# EAGLE design Grove expansion v4 for box (EAGLE 9.4.2)

## Sheet 1 of 2
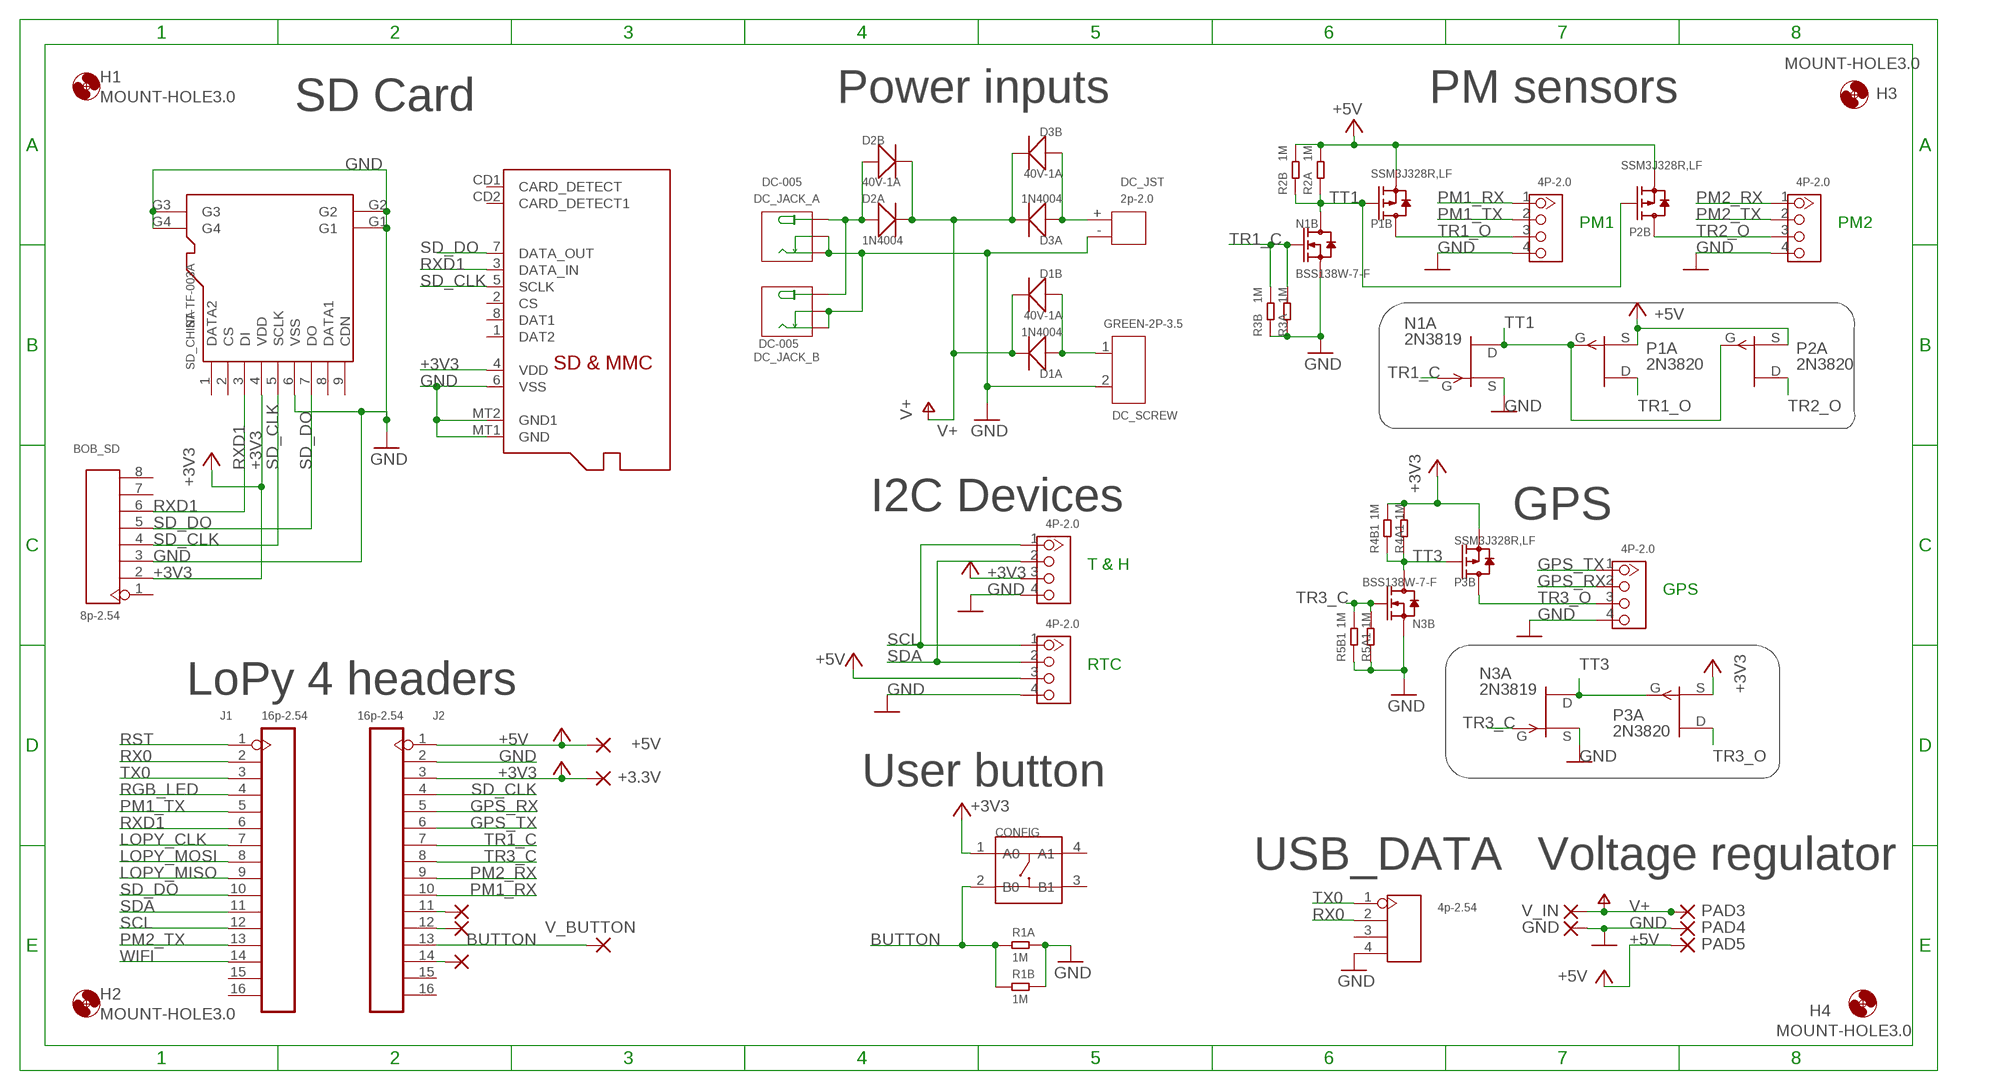
[diagram p0: schematic, sheet 1]

### Parts
+3.3V  2,15/1,0  [2,15/1,0]
+5V  2,15/1,0  [2,15/1,0]
BOB_SD  8p-2.54  DIP-BLACK-FEMALE-HEADER-VERT(8P-2.54)  [H8-2.54]
CONFIG  DIP-SWITCH-TACTILE-SPST-NO/TS-1109(4P-D6.0MM)'TS-1109'  [SW4-6.0X6.0X5.0MM]
D1A  1N4004  DIP-DIODE-400V-1A(DO-41)  [DO-41]
D1B  40V-1A  SMD-DIODE-SCHOTTKY-40V-1A(DO-214AC)  [DO-214AC]
D2A  1N4004  DIP-DIODE-400V-1A(DO-41)  [DO-41]
D2B  40V-1A  SMD-DIODE-SCHOTTKY-40V-1A(DO-214AC)  [DO-214AC]
D3A  1N4004  DIP-DIODE-400V-1A(DO-41)  [DO-41]
D3B  40V-1A  SMD-DIODE-SCHOTTKY-40V-1A(DO-214AC)  [DO-214AC]
DC_JACK_A  DC-005  CONN-POWER-JACK-2.1MM(DC-005)  [DCJ3P-14.2X11.0X9.0MM]
DC_JACK_B  DC-005  CONN-POWER-JACK-2.1MM(DC-005)  [DCJ3P-14.2X11.0X9.0MM]
DC_JST  2p-2.0  DIP-JST-2P-2.0  [H2-2.0-6X4.5MM]
DC_SCREW  GREEN-2P-3.5  SCREW-TERMINAL-GREEN(2P-3.5)  [H2-3.5-7.0X7.0MM]
GND  2,15/1,0  [2,15/1,0]
GPS-(DIG)  4P-2.0  GROVE-CONNECTOR-DIP(4P-2.0)  [HW4-2.0]
H1  MOUNT-HOLE3.0  [3,0]
H2  MOUNT-HOLE3.0  [3,0]
H3  MOUNT-HOLE3.0  [3,0]
H4  MOUNT-HOLE3.0  [3,0]
J1  16p-2.54  DIP-BLACK-MALE-HEADER-VERT(16P-2.54)  [H16-2.54]
J2  16p-2.54  DIP-BLACK-MALE-HEADER-VERT(16P-2.54)  [H16-2.54]
N1A  2N3819  [TO92]
N1B  BSS138W-7-F  SMD-MOSFET-N-CH-50V-200MA-BSS138W-7-F(SOT-23)  [SOT-23]
N3A  2N3819  [TO92]
N3B  BSS138W-7-F  SMD-MOSFET-N-CH-50V-200MA-BSS138W-7-F(SOT-23)  [SOT-23]
P1A  2N3820  [TO92]
P1B  SSM3J328R,LF  SMD-MOSFET-P-CH-20V-6A-SSM3J328R(SOT-23)  [SOT-23]
P2A  2N3820  [TO92]
P2B  SSM3J328R,LF  SMD-MOSFET-P-CH-20V-6A-SSM3J328R(SOT-23)  [SOT-23]
P3A  2N3820  [TO92]
P3B  SSM3J328R,LF  SMD-MOSFET-P-CH-20V-6A-SSM3J328R(SOT-23)  [SOT-23]
P13  2,15/1,0  [2,15/1,0]
P15  2,15/1,0  [2,15/1,0]
P16  2,15/1,0  [2,15/1,0]
PAD3  1,6/0,8  [1,6/0,8]
PAD4  1,6/0,8  [1,6/0,8]
PAD5  1,6/0,8  [1,6/0,8]
PM1-(UART)  4P-2.0  GROVE-CONNECTOR-DIP(4P-2.0)  [HW4-2.0]
PM2-(UART)  4P-2.0  GROVE-CONNECTOR-DIP(4P-2.0)  [HW4-2.0]
R1A  1M  DIP-RES-1M-5%-1/4W(PR-D2.3XL6.5MM)  [PR-D2.3XL6.5MM]
R1B  1M  SMD-RES-1M-1%-1/10W(0603)  [R0603]
R2A  1M  DIP-RES-1M-5%-1/4W(PR-D2.3XL6.5MM)  [PR-D2.3XL6.5MM]
R2B  1M  SMD-RES-1M-1%-1/10W(0603)  [R0603]
R3A  1M  DIP-RES-1M-5%-1/4W(PR-D2.3XL6.5MM)  [PR-D2.3XL6.5MM]
R3B  1M  SMD-RES-1M-1%-1/10W(0603)  [R0603]
R4A1  1M  DIP-RES-1M-5%-1/4W(PR-D2.3XL6.5MM)  [PR-D2.3XL6.5MM]
R4B1  1M  SMD-RES-1M-1%-1/10W(0603)  [R0603]
R5A1  1M  DIP-RES-1M-5%-1/4W(PR-D2.3XL6.5MM)  [PR-D2.3XL6.5MM]
R5B1  1M  SMD-RES-1M-1%-1/10W(0603)  [R0603]
RTC-(I2C)  4P-2.0  GROVE-CONNECTOR-DIP(4P-2.0)  [HW4-2.0]
SD_CHINA  ST-TF-003A  MICRO-SD-CARD-SOCKET-9P(ST-TF-003A)  [MICRO-SD9+4P-SMD-16.1X14.5X1.85MM]
SD_UK  MICROSD  [MICROSD]
TH-(I2C)  4P-2.0  GROVE-CONNECTOR-DIP(4P-2.0)  [HW4-2.0]
USB_DATA  4p-2.54  DIP-BLACK-FEMALE-HEADER-VERT(4P-2.54)  [H4-2.54]
V_BUTTON  2,15/1,0  [2,15/1,0]
V_IN  2,15/1,0  [2,15/1,0]

### Nets
+3V3: +3.3V.1(P) BOB_SD.2 CONFIG.1(A0) J2.3 P3A.1(S) P3B.2(S) R4A1.2 R4B1.2 SD_CHINA.4(VDD) SD_UK.4(VDD) TH-(I2C).3
+5V: +5V.1(P) J2.1 P1A.1(S) P1B.2(S) P2A.1(S) P2B.2(S) PAD5.1(P) R2A.2 R2B.2 RTC-(I2C).3
BUTTON: CONFIG.2(B0) J2.13 R1A.1 R1B.1 V_BUTTON.1(P)
GND: BOB_SD.3 DC_JACK_A.-1(-) DC_JACK_A.-2(CDN) DC_JACK_B.-1(-) DC_JACK_B.-2(CDN) DC_JST.- DC_SCREW.2 GND.1(P) GPS-(DIG).4 J2.2 N1A.3(S) N1B.2(S) N3A.3(S) N3B.2(S) PAD4.1(P) PM1-(UART).4 PM2-(UART).4 R1A.2 R1B.2 R3A.1 R3B.1 R5A1.1 R5B1.1 RTC-(I2C).4 SD_CHINA.6(VSS) SD_CHINA.G1 SD_CHINA.G2 SD_CHINA.G3 SD_CHINA.G4 SD_UK.6(VSS) SD_UK.MT1(GND) SD_UK.MT2(GND1) TH-(I2C).4 USB_DATA.4
GPS_RX: GPS-(DIG).2 J2.5
GPS_TX: GPS-(DIG).1 J2.6
JACK_V+: D2A.1(+) D2B.1(+) DC_JACK_A.+ DC_JACK_B.+
JST_V+: D3A.1(+) D3B.1(+) DC_JST.+
LOPY_CLK: J1.7
LOPY_MISO: J1.9
LOPY_MOSI: J1.8
N$1: J2.11 P16.1(P)
N$2: J2.12 P15.1(P)
N$3: J2.14 P13.1(P)
PM1_RX: J2.10 PM1-(UART).1
PM1_TX: J1.5 PM1-(UART).2
PM2_RX: J2.9 PM2-(UART).1
PM2_TX: J1.13 PM2-(UART).2
RGB_LED: J1.4
RST: J1.1
RX0: J1.2 USB_DATA.2
RXD1: BOB_SD.6 J1.6 SD_CHINA.3(DI) SD_UK.3(DATA_IN)
SCL: J1.12 RTC-(I2C).1 TH-(I2C).1
SCREW_V+: D1A.1(+) D1B.1(+) DC_SCREW.1
SD_CLK: BOB_SD.4 J2.4 SD_CHINA.5(SCLK) SD_UK.5(SCLK)
SD_DO: BOB_SD.5 J1.10 SD_CHINA.7(DO) SD_UK.7(DATA_OUT)
SDA: J1.11 RTC-(I2C).2 TH-(I2C).2
TR1_C: J2.7 N1A.2(G) N1B.1(G) R3A.2 R3B.2
TR1_O: P1A.3(D) P1B.3(D) PM1-(UART).3
TR2_O: P2A.3(D) P2B.3(D) PM2-(UART).3
TR3_C: J2.8 N3A.2(G) N3B.1(G) R5A1.2 R5B1.2
TR3_O: GPS-(DIG).3 P3A.3(D) P3B.3(D)
TT1: N1A.1(D) N1B.3(D) P1A.2(G) P1B.1(G) P2A.2(G) P2B.1(G) R2A.1 R2B.1
TT3: N3A.1(D) N3B.3(D) P3A.2(G) P3B.1(G) R4A1.1 R4B1.1
TX0: J1.3 USB_DATA.1
V+: D1A.2(-) D1B.2(-) D2A.2(-) D2B.2(-) D3A.2(-) D3B.2(-) PAD3.1(P) V_IN.1(P)
WIFI: J1.14
Unconnected: BOB_SD.1 BOB_SD.7 BOB_SD.8 CONFIG.3(B1) CONFIG.4(A1) J1.15 J1.16 J2.15 J2.16 SD_CHINA.1(DATA2) SD_CHINA.2(CS) SD_CHINA.8(DATA1) SD_CHINA.9(CDN) SD_UK.1(DAT2) SD_UK.2(CS) SD_UK.8(DAT1) SD_UK.CD1(CARD_DETECT) SD_UK.CD2(CARD_DETECT1) USB_DATA.3

### Notes on the sheet
- SD Card | Power inputs | PM sensors
- PM1 | PM2
- I2C Devices | GPS
- T & H
- GPS
- RTC
- LoPy 4 headers
- User button
- Voltage regulator

## Sheet 2 of 2

## Library data of the parts
+3.3V +5V GND P13 P15 P16 V_BUTTON V_IN = wirepad:2,15/1,0: THROUGH-HOLE PAD
BOB_SD = OPL_Connector:DIP-BLACK-FEMALE-HEADER-VERT(8P-2.54): 320030061; MPN: F185-1108A1BSYC1
CONFIG = OPL_Switch:DIP-SWITCH-TACTILE-SPST-NO/TS-1109(4P-D6.0MM): 311020024
D1A D2A D3A = OPL_Discrete_Semiconductor:DIP-DIODE-400V-1A(DO-41): 304010008; MPN: 1N4004
D1B D2B D3B = OPL_Discrete_Semiconductor:SMD-DIODE-SCHOTTKY-40V-1A(DO-214AC): 304020027; MPN: 1N5819
DC_JACK_A DC_JACK_B = OPL_Connector:CONN-POWER-JACK-2.1MM(DC-005): 320120003; MPN: DC-005
DC_JST = OPL_Connector:DIP-JST-2P-2.0: 320110049
DC_SCREW = OPL_Connector:SCREW-TERMINAL-GREEN(2P-3.5): 320110028
GPS-(DIG) PM1-(UART) PM2-(UART) RTC-(I2C) TH-(I2C) = OPL_Connector:GROVE-CONNECTOR-DIP(4P-2.0): 320110033
H1-H4 = holes:MOUNT-HOLE: MOUNTING HOLE with drill center marker
J1 J2 = OPL_Connector:DIP-BLACK-MALE-HEADER-VERT(16P-2.54): 320020034; MPN: P125-1116A0BS116AX
N1A N3A = transistor-fet:2N3819: N-Channel Junction FET
N1B N3B = OPL_Discrete_Semiconductor:SMD-MOSFET-N-CH-50V-200MA-BSS138W-7-F(SOT-23): 305030000; MPN: BSS138W-7-F
P1A P2A P3A = transistor-fet:2N3820: P-Channel Junction FET Source: http://www.fairchildsemi.com/ds/2N/2N3820.pdf
P1B P2B P3B = OPL_Discrete_Semiconductor:SMD-MOSFET-P-CH-20V-6A-SSM3J328R(SOT-23): 305030075; MPN: SSM3J328R,LF
PAD3-PAD5 = wirepad:1,6/0,8: THROUGH-HOLE PAD
R1A R2A R3A R4A1 R5A1 = OPL_Resistor:DIP-RES-1M-5%-1/4W(PR-D2.3XL6.5MM): 301020005; MPN: FHCFR-1/4W-105J
R1B R2B R3B R4B1 R5B1 = OPL_Resistor:SMD-RES-1M-1%-1/10W(0603): 301012044; MPN: RC0603FR-071ML
SD_CHINA = OPL_Connector:MICRO-SD-CARD-SOCKET-9P(ST-TF-003A): 320090000; MPN: ST-TF-003A
SD_UK = adafruit:MICROSD: Micro-SD / Transflash card holder with SPI pinout For the 3M # 2908-05WB-MG and/or 4UCON #19656 push-push type
USB_DATA = OPL_Connector:DIP-BLACK-FEMALE-HEADER-VERT(4P-2.54): 320030017; MPN: F185-1104A1BSYA1

## Board
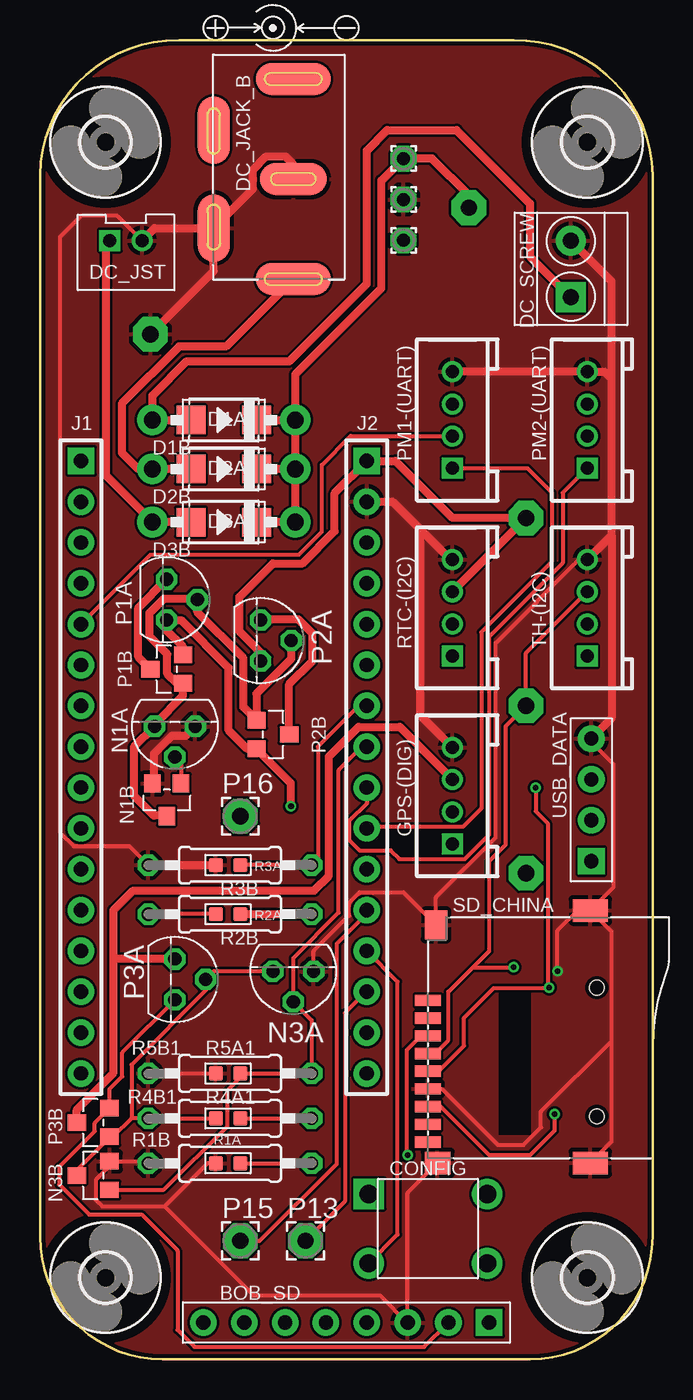
[diagram p1: board, top side]
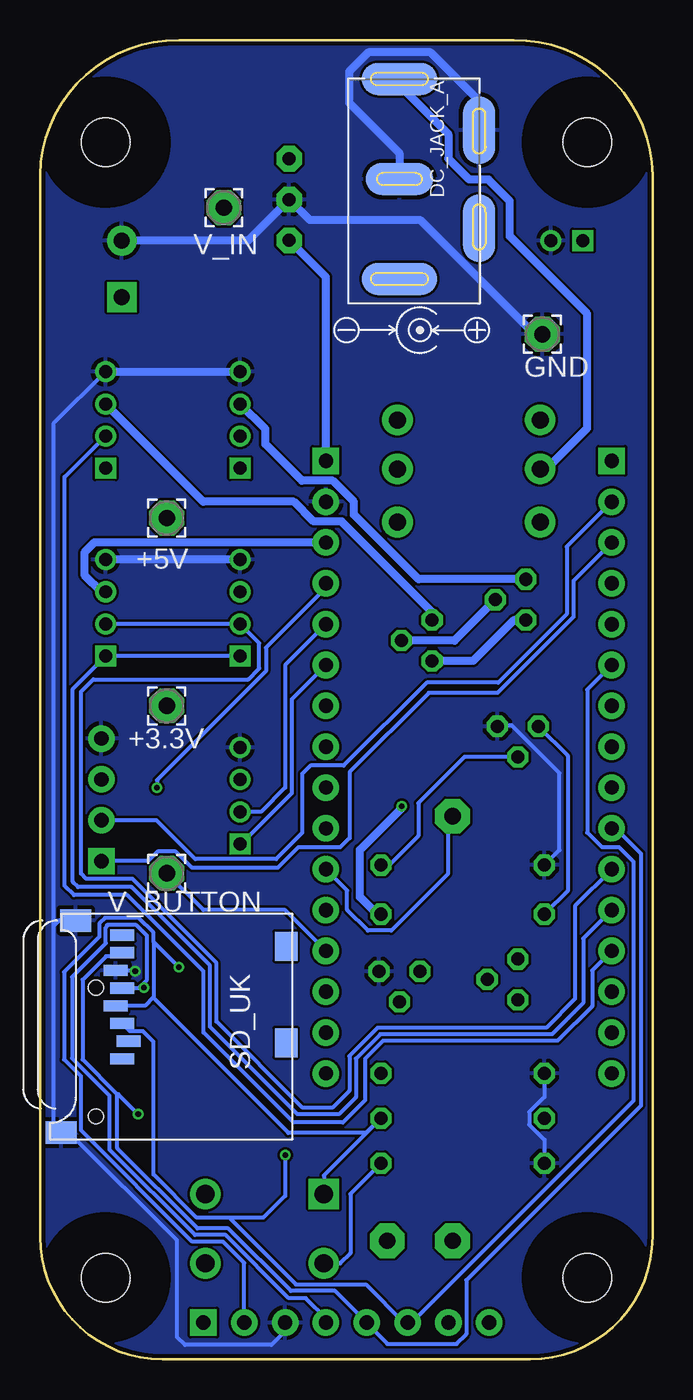
[diagram p2: board, bottom side, seen from below]

Size 38.1 x 82.04 mm. Coordinates in mm from the lower left corner, seen from the top.
Outline: 0,7.62 0,73.66 arc-90 8.64,82.04 29.46,82.04 arc-90 38.1,73.66 38.1,7.62 arc-90 30.48,0 7.62,0 arc-90 0,7.62
Copper layers (1*16): Top 0.035mm / dielectric 1.5mm / Bottom 0.035mm
Design rules "SeeedStudio_2layer_DRU_no_angle_20140221": minimum track width 6mil, minimum drill 12mil, track to track 6mil, track to pad 6mil, pad to pad 6mil, via to via 6mil, smd to smd 0mil, copper to edge 10mil, drill to drill 10mil, minimum pad ring 10mil, minimum via ring 6mil, stop-mask expansion 2mil, vias tented up to drill 100mil, thermal gap 10mil

### Footprints (pad centres in the part's own frame; a part is rotated, then mirrored left to right if it is on the bottom)
2,15/1,0 = drill 1.016 pad 2.159 octagon: 1 0,0
H8-2.54 = drill 0.889 pad 1.651 square: 1 0,8.89 | drill 0.889 pad 1.651: 2 0,6.35; 3 0,3.81; 4 0,1.27; 5 0,-1.27; 6 0,-3.81; 7 0,-6.35; 8 0,-8.89
SW4-6.0X6.0X5.0MM = drill 1.143 pad 1.905 square: 1 -3.683,2.159 | drill 1.143 pad 1.905: 2 -3.683,-2.159; 3 3.683,-2.159; 4 3.683,2.159
DO-41 = drill 1.041 pad 1.905: 1 -4.445,0; 2 4.445,0
DO-214AC = smd 1.8 x 1.77: 1 -2.042,0; 2 2.042,0
DCJ3P-14.2X11.0X9.0MM = smd 2 x 4.7: + 3.175,0 | smd 2 x 4.7 bottom: +1 3.175,0 | smd 2 x 4.2: -1 -3.048,0 | smd 4.2 x 2: -2 0,-4.953 | smd 2 x 4.2 bottom: -3 -3.048,0 | smd 4.2 x 2 bottom: -4 0,-4.953
H2-2.0-6X4.5MM = drill 0.8 pad 1.3 square: + -1,0.75 | drill 0.8 pad 1.3: - 1,0.75
H2-3.5-7.0X7.0MM = drill 1 pad 1.85 square: 1 -1.75,0 | drill 1 pad 1.85: 2 1.75,0
HW4-2.0 = drill 0.8 pad 1.27 square: 1 -3,0 | drill 0.8 pad 1.27: 2 -1,0; 3 1,0; 4 3,0
3,0 = hole 3: 0,0
H16-2.54 = drill 0.889 pad 1.651 square: 1 0,-19.05 | drill 0.889 pad 1.651: 2 0,-16.51; 3 0,-13.97; 4 0,-11.43; 5 0,-8.89; 6 0,-6.35; 7 0,-3.81; 8 0,-1.27; 9 0,1.27; 10 0,3.81; 11 0,6.35; 12 0,8.89; 13 0,11.43; 14 0,13.97; 15 0,16.51; 16 0,19.05
TO92 = drill 0.813 octagon: 1 1.27,0; 2 0,1.905; 3 -1.27,0
SOT-23 = smd 1.016 x 1.143: 1 -0.889,-1.016; 2 0.889,-1.016; 3 0,1.016
1,6/0,8 = drill 0.813 pad 1.6 octagon: 1 0,0
PR-D2.3XL6.5MM = drill 0.813 octagon: 1 -4.953,0; 2 5.207,0
R0603 = smd 0.889 x 0.889: 1 0,0.762; 2 0,-0.762
MICRO-SD9+4P-SMD-16.1X14.5X1.85MM = smd 1.6 x 0.7: 1 0,2.25; 2 0,1.15; 3 0,0.05; 4 0,-1.05; 5 0,-2.15; 6 0,-3.25; 7 0,-4.35; 8 0,-5.45; 9 0,-6.55 | smd 1.6 x 1.4: G1 0.6,-7.85 | smd 2.2 x 1.4: G2 10.1,-7.85; G3 10.1,7.85 | smd 1.4 x 1.8: G4 0.5,6.95 | hole 0.9: 10.5,-4.95; 10.5,3.05
MICROSD = smd 0.7 x 1.5: 1 9,-10.64; 2 7.9,-10.24; 3 6.8,-10.64; 4 5.7,-11.04; 5 4.6,-10.64; 6 3.5,-11.04; 7 2.4,-10.64; 8 1.3,-10.64 | smd 1.8 x 1.4: CD1 2,-0.44; CD2 8,-0.44 | smd 1.4 x 1.9: MT1 0.4,-13.54; MT2 13.6,-14.44
H4-2.54 = drill 0.889 pad 1.651 square: 1 0,3.81 | drill 0.889 pad 1.651: 2 0,1.27; 3 0,-1.27; 4 0,-3.81

### Placement (x,y rotation side)
+3.3V  30.23,40.64 0 bottom
+5V  30.23,52.32 0 bottom
BOB_SD  19.05,2.29 270 top
CONFIG  24.13,8.13 0 top
D1A  11.43,58.42 0 top
D1B  11.43,58.42 0 top
D2A  11.43,55.37 0 top
D2B  11.43,55.37 0 top
D3A  11.43,52.07 0 top
D3B  11.43,52.07 0 top
DC_JACK_A  15.75,76.45 90 bottom
DC_JACK_B  15.75,70.36 270 top
DC_JST  5.33,68.83 0 top
DC_SCREW  33.02,67.82 90 top
GND  6.86,63.75 0 bottom
GPS-(DIG)  25.65,35.05 90 top
H1  34.04,5.08 0 top
H2  4.06,75.69 0 top
H3  34.04,75.69 0 top
H4  4.06,5.08 0 top
J1  2.54,36.83 180 top
J2  20.32,36.83 180 top
N1A  8.38,39.37 180 top
N1B  7.87,34.8 180 top
N3A  15.75,24.13 180 top
N3B  3.3,11.43 90 top
P1A  7.87,47.24 270 top
P1B  7.87,42.93 90 top
P2A  13.72,44.7 270 top
P2B  14.48,38.86 270 top
P3A  8.38,23.62 270 top
P3B  3.3,14.73 90 top
P13  16.51,7.37 0 top
P15  12.45,7.37 0 top
P16  12.45,33.78 0 top
PAD3  22.61,74.68 90 top
PAD4  22.61,72.14 90 top
PAD5  22.61,69.6 90 top
PM1-(UART)  25.65,58.42 90 top
PM2-(UART)  34.04,58.42 90 top
R1A  11.94,12.19 180 top
R1B  11.68,12.19 270 top
R2A  11.68,27.69 0 top
R2B  11.68,27.69 90 top
R3A  11.68,30.73 0 top
R3B  11.68,30.73 90 top
R4A1  11.68,14.99 0 top
R4B1  11.68,14.99 90 top
R5A1  11.68,17.78 0 top
R5B1  11.68,17.78 90 top
RTC-(I2C)  25.65,46.74 90 top
SD_CHINA  24.13,20.07 0 top
SD_UK  22.35,27.69 270 bottom
TH-(I2C)  34.04,46.74 90 top
USB_DATA  34.29,34.8 180 top
V_BUTTON  30.23,30.23 0 bottom
V_IN  26.67,71.63 0 bottom

### Tracks (layer width: path | path; a pad name or v marks a point on that pad's centre or on a via)
+3V3  (via drill 0.35)
  Top 0.254: BOB_SD.2 23.89,0.78 9.6,0.78 8.55,1.83 8.55,6.78 6.31,9.02 3.04,9.02 1.18,10.88 1.18,11.98 3.39,14.19 3.39,14.69 P3B.2 4.32,16.81 5.11,17.59 5.11,19.07 P3A.1 | R4B1.2 R4A1.2 | SD_CHINA.4 24.17,18.98 24.54,18.98 25.4,19.84 25.4,22.86 26.92,24.38 | 26.92,24.38 27.94,25.4 27.94,30.99 28.96,32 28.96,39.37 +3.3V.1 30.23,43.93 TH-(I2C).3 | 26.92,24.38 v29.46,24.38
  Bottom 0.254: 31.05,25.97 31.05,22.52 31.07,22.49 | 31.07,22.49 31.58,21.99 SD_UK.4 | BOB_SD.2 25.4,5.99 26.73,7.32 28.64,7.32 35.56,14.24 35.56,17.59 36.61,18.65 36.61,24.09 34.43,26.28 34.43,27.11 34.07,27.46 31.97,27.46 31.05,26.54 31.05,25.97 | 31.07,22.49 22.65,14.07 17.83,14.07 16.91,14.99 R4A1.2 20.45,11.43 CONFIG.1 | v29.46,24.38 31.05,25.97
  Bottom 0.508: TH-(I2C).3 34.3,47.74 35.35,48.79 35.35,50.17 34.73,50.8 J2.3
+5V  (via drill 0.35)
  Top 0.508: R2B.2 R2A.2 | RTC-(I2C).3 30.23,52.31 +5V.1 25.65,52.32 22.1,55.88 J2.1 18.31,53.87 18.31,51.5 16.31,49.51 14.48,49.51 12.39,47.42 12.39,45.28 13.72,43.96 P2A.1 | P1B.2 8.89,44.32 7.87,45.34 P1A.1 8.77,45.97 11.73,43.01 11.73,39.12 12.88,37.97 P2B.2 15.61,35.83 v15.61,34.4
  Bottom 0.508: J2.1 20.32,67.31 PAD5.1 | P1A.1 8.64,45.97 11.18,43.43 P2A.1 | v15.61,34.4 15.61,34.29 18.21,31.68 18.21,28.75 17.14,27.69 R2A.2
BUTTON
  Top 0.254: CONFIG.2 22.24,7.76 22.24,23.48 J2.13 | R1B.1 R1A.1
  Bottom 0.254: V_BUTTON.1 27.94,27.94 22.86,27.94 J2.13 | R1A.1 18.8,10.29 18.8,6.6 19.43,5.97 CONFIG.2
GND  (via drill 0.35)
  Top 0.254: 24.73,12.57 SD_CHINA.G1 22.86,10.35 BOB_SD.3 22.86,2.25 21.13,3.98 13.26,3.98 7.74,9.5 | DC_JST.- 4.8,71.12 2.54,71.12 1.22,69.8 1.22,32.78 2.08,31.91 5.55,31.91 R3A.1 | USB_DATA.4 34.29,38.39 35.65,37.03 35.65,29.34 SD_CHINA.G3 | 11.23,17.78 R5B1.1 R5A1.1 | SD_CHINA.G3 35.56,26.59 35.56,19.81 | SD_CHINA.G3 33.44,27.92 32.19,26.67 v32.19,24.13 | SD_CHINA.G2 35.56,13.55 35.56,19.81 | SD_CHINA.6 24.99,16.82 28.48,13.33 30.07,13.33 31.16,14.42 31.16,15.42 35.56,19.81 | N1A.3 9.65,39.12 | R1A.2 6.6,12.32 N3B.2 4.45,12.19 4.45,12.14 3.47,11.16 3.47,9.92 3.88,9.5 7.74,9.5 | TH-(I2C).4 33.53,49.74 28.35,44.55 28.35,32.47 24.63,28.75 SD_CHINA.G4 22.6,29.05 19.86,29.05 19.21,28.4 19.21,27.6 17.02,25.4 N3A.3 | R1B.2 10.43,12.19 7.74,9.5
  Top 0.508: DC_JST.- 7.11,70.36 DC_JACK_B.-2 | DC_JACK_B.-2 13.24,72.81 13.24,73.99 14.06,74.81 15.25,74.81 15.75,74.31 DC_JACK_B.-1 | N1A.3 9.07,38.79 8.19,38.79 7.06,37.65 7.06,35.89 N1B.2 | R3A.1 R3B.1 | 35.56,51.26 TH-(I2C).4 | 35.56,51.26 35.56,39.88 USB_DATA.4 | J2.2 21.93,53.34 23.66,51.6 | RTC-(I2C).4 25.53,49.74 23.66,51.6 | DC_SCREW.2 35.56,67.03 35.56,60.96 | PM1-(UART).4 PM2-(UART).4 35.1,61.42 35.56,60.96 | GPS-(DIG).4 23.66,40.04 23.66,51.6 | GND.1 10.79,67.69 DC_JACK_B.-2 | 35.56,51.26 35.56,60.96
  Bottom 0.254: PM2-(UART).4 37.27,58.18 37.27,26.92 | 37.27,26.92 37.27,14.41 36.95,14.09 SD_UK.MT2 36.28,14.09 29.59,7.39 29.59,1.38 29.1,0.89 23.71,0.89 22.86,1.74 BOB_SD.3 | SD_UK.6 32.25,24.19 v32.19,24.13 | R5A1.1 6.73,16.32 7.67,15.38 7.67,14.6 6.73,13.66 R1A.2 | N1A.3 9.6,39.42 8.76,39.42 5.79,36.46 5.79,31.67 R3A.1 | SD_UK.MT1 36.91,27.29 37.27,26.92
  Bottom 0.508: DC_JACK_A.-2 10.79,78.27 13.81,81.29 17.68,81.29 18.88,80.09 18.88,78.15 15.75,75.02 DC_JACK_B.-1 | RTC-(I2C).4 TH-(I2C).4 | GND.1 7.37,63.75 14.48,70.87 21.34,70.87 PAD4.1 25.17,69.57 DC_SCREW.2 | PM1-(UART).4 PM2-(UART).4 33.32,61.42
  pour Top: -1.27,85.09 -1.27,-1.27 39.37,-1.27 39.37,85.09
  pour Bottom: -2.79,86.36 -2.79,-2.54 40.64,-2.54 40.64,86.36
GPS_RX
  Bottom 0.254: J2.5 22.86,43.18 22.86,35.56 24.37,34.05 GPS-(DIG).2
GPS_TX
  Bottom 0.254: J2.6 22.45,41.05 22.45,35.2 25.61,32.05 GPS-(DIG).1
JACK_V+
  Top 0.508: D2B.1 D2A.1 6.1,55.37 5.08,56.39 5.08,59.44 8.64,62.99 11.56,62.99 DC_JACK_B.+
  Bottom 0.508: DC_JACK_A.+ 15.75,79.25 12.7,76.2 12.7,74.68 11.4,73.37 10.21,73.37 8.88,72.04 8.88,69.84 4.06,65.02 4.06,57.91 6.6,55.37 D2A.1
JST_V+
  Top 0.508: D3B.1 D3A.1 4.06,54.99 4.06,69.31 DC_JST.+
N$1
  Bottom 0.254: P16.1 12.7,33.53 12.7,30.23 16.26,26.67 17.71,26.67 19,27.96 19,29.16 J2.11
N$2
  Top 0.254: P15.1 13.65,7.37 18.45,12.17 18.45,25.86 20.32,27.73 J2.12
N$3
  Top 0.254: J2.14 20.28,22.86 18.96,21.54 18.96,9.82 P13.1
PM1_RX
  Top 0.254: PM1-(UART).1 30.32,55.42 31.84,53.9 31.84,49.62 27.45,45.23 27.45,34.27 26.3,33.12 20.42,33.12 J2.10
PM1_TX
  Top 0.254: J1.5 6.86,50.04 16.09,50.04 17.53,51.47 17.53,55.63 19.32,57.42 PM1-(UART).2
PM2_RX
  Top 0.254: J2.9 20.32,34.58 19.21,33.48 19.21,32.31 19.86,31.66 21.8,31.66 22.34,31.12 26.42,31.12 27.94,32.63 27.94,44.96 32.51,49.53 32.51,53.9 PM2-(UART).1
PM2_TX
  Bottom 0.254: PM2-(UART).2 36.58,54.88 36.58,29.45 35.99,28.87 32.68,28.87 27.94,24.13 27.94,20.32 22.35,14.73 19.27,14.73 17.89,16.11 17.89,18.69 16.76,19.81 5.91,19.81 3.76,21.96 3.76,24.18 J1.13
RX0
  Bottom 0.254: J1.2 5.33,50.55 5.33,46.35 9.59,42.09 14.05,42.09 19.21,36.92 21.29,36.92 21.79,36.41 21.79,32.75 23.43,31.12 28.46,31.12 30.86,33.53 USB_DATA.2
RXD1  (via drill 0.35)
  Top 0.254: SD_CHINA.3 24.09,20.15 23.72,20.15 22.8,19.23 22.8,12.76 v22.86,12.7
  Bottom 0.254: SD_UK.3 32.52,20.41 31.73,20.41 31.05,19.75 31.05,11.5 28.36,8.8 26.33,8.8 | 26.33,8.8 22.19,4.66 17.83,4.66 15.46,2.29 BOB_SD.6 14.99,2.29 1.18,16.09 1.18,30.94 2.08,31.84 3.14,31.84 4.06,32.77 4.06,41.66 J1.6 | v22.86,12.7 22.86,10.16 24.22,8.8 26.33,8.8
SCL
  Bottom 0.254: J1.12 4.32,26.16 4.32,22.17 6.27,20.22 16.93,20.22 18.45,18.7 18.45,16.31 19.52,15.24 22.1,15.24 27.53,20.68 27.53,24.49 32.42,29.38 35.74,29.38 36.07,29.7 36.07,41.7 TH-(I2C).1 RTC-(I2C).1
SCREW_V+
  Top 0.508: D1B.1 D1A.1 6.99,59.94 9.12,62.08 15.51,62.08 20.32,66.89 20.32,75.18 21.59,76.45 25.91,76.45 30.48,71.88 30.48,68.58 32.99,66.07 DC_SCREW.1
SD_CLK  (via drill 0.35)
  Top 0.254: 31.59,23.18 v31.66,23.11 | v30.83,35.56 30.83,34.08 31.59,33.33 31.59,23.18 | SD_CHINA.5 24.79,17.92 26.37,19.49 26.37,21.24 28.22,23.09 31.49,23.09 31.59,23.18
  Bottom 0.254: BOB_SD.4 20.32,2.54 21.59,3.81 22.64,3.81 26.56,7.73 28.47,7.73 33.78,13.04 33.78,16.39 36.12,18.73 36.12,23.78 34.02,25.88 34.02,26.85 33.95,26.93 33.95,27.02 32.13,27.02 31.45,26.34 31.45,23.61 31.98,23.09 SD_UK.5 32.96,23.11 v31.66,23.11 | J2.4 20.32,48.01 24.06,44.27 24.06,42.8 30.83,36.02 v30.83,35.56
SD_DO  (via drill 0.35)
  Top 0.254: v32,15.24 32,14.22 30.48,12.7 27.94,12.7 24.92,15.72 SD_CHINA.7
  Bottom 0.254: SD_UK.7 33.21,25.07 34,25.07 35.46,23.61 35.46,18.64 33.3,16.48 | 33.3,16.48 33.3,13.13 28.31,8.15 26.4,8.15 22.51,4.25 19.75,4.25 BOB_SD.5 17.78,2.25 16.5,0.96 12.19,0.96 11.6,1.56 11.6,4.92 0.71,15.8 0.71,31.45 2.29,33.02 J1.10 | 33.3,16.48 33.25,16.48 v32,15.24
SDA
  Bottom 0.254: J1.11 4.83,28.19 4.83,22.42 6.62,20.62 17.1,20.62 18.86,18.87 18.86,16.7 19.91,15.65 21.76,15.65 27.13,21.01 27.13,24.65 32.36,29.88 35.23,29.88 35.56,30.21 35.56,41.52 34.79,42.3 25.14,42.3 24.47,42.97 24.47,44.55 RTC-(I2C).2 TH-(I2C).2
TR1_C
  Top 0.254: J2.7 19.81,40.64 17.27,38.1 17.27,30.99 17.02,30.73 R3B.2 R3A.2 | N1A.2 8.76,37.08 N1B.1
  Bottom 0.254: R3A.2 16.38,30.73 14.57,32.55 14.57,34.6 11.7,37.47 N1A.2
TR1_O
  Top 0.508: P1B.3 6.1,43.69 6.1,46.74 P1A.3
  Bottom 0.508: P1A.3 14.56,48.51 18.58,52.53 18.58,53.34 19.89,54.65 21.82,54.65 24.09,56.92 24.09,57.86 PM1-(UART).3
TR2_O
  Top 0.508: P2B.3 15.49,41.99 16.94,43.44 16.94,45.15 16.06,46.02 13.77,46.02 P2A.3
  Bottom 0.508: P2A.3 13.72,46.48 19.34,52.11 21.08,52.11 22.32,53.34 27.96,53.34 PM2-(UART).3
TR3_C
  Top 0.254: J2.8 20.03,38.1 18.57,36.64 18.57,27.78 15.75,24.96 N3A.2 16.89,21.08 R5A1.2 12.7,17.78 | R5B1.2 12.7,17.78 | 12.7,17.78 11.65,16.73 11.65,14.49 7.7,10.54 N3B.1
TR3_O
  Top 0.508: GPS-(DIG).3 22.37,39.33 19.81,39.33 17.96,37.48 17.96,30.07 17.04,29.16 5.79,29.16 4.57,27.94 4.57,24.89 | P3B.3 2.29,15.53 4.57,17.82 4.57,24.89 | P3A.3 4.57,24.89
TT1
  Top 0.254: R2B.1 R2A.1
  Top 0.508: N1B.3 7.84,33.82 7.07,33.82 5.82,35.07 5.82,38.08 N1A.1 7.11,39.5 8.89,41.27 P1B.1 8.51,42.04 7.91,42.63 7.91,43.86 6.81,44.96 6.81,46.42 7.69,47.3 9.73,47.3 P1A.2 9.78,46.48 12.65,43.61 12.65,40.56 P2B.1 13.46,41.4 15.62,43.56 P2A.2
  Bottom 0.254: R2A.1 5.28,29.13 5.28,37.54 N1A.1
  Bottom 0.508: P2A.2 12.32,44.7 P1A.2
TT3
  Top 0.254: N3A.1 10.79,24.13 P3A.2 10.34,23.57 10.34,22.98 5.68,18.32 5.68,15 | 5.68,15 4.52,13.84 P3B.1 4.32,13.79 2.29,11.76 N3B.3 | R4B1.1 R4A1.1 5.69,14.99 5.68,15
TX0
  Bottom 0.254: USB_DATA.1 31.39,30.99 30.79,31.59 29.66,31.59 28.65,30.57 23.32,30.57 22.05,31.84 19.43,31.84 18.85,32.42 18.85,36.52 13.92,41.45 9.65,41.45 4.93,46.18 4.93,48.41 J1.3
V+
  Top 0.508: D1B.2 D1A.2 | D2A.2 D2B.2 | D3B.2 D3A.2 D2A.2 | D2A.2 D1A.2 | D1A.2 15.88,61.26 21.23,66.62 21.23,73.3 PAD3.1 24.38,74.68 26.67,72.39 V_IN.1

### Text on the board
silktop: PyonAir V4 | 6.5 - 40 V | . | + | + | - | V-reg | + | - | + | LoPy / LED | +5V | +5V | + | +5V | 3V3 | - GND | 3V3 | - RX - | NC | TX | x / x | x / x | 3V3
silkbottom: + | + | - | CC-BY-SA | + | - | + | pyonair.org | University of / Southampton | https://github.com/pyonair/PyonAir-pycom